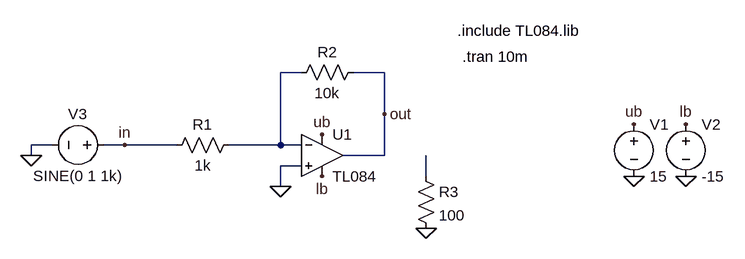
[diagram p0: schematic Labo1_Inverseur.asc]
Labo1_Inverseur.asc, the LTspice schematic file:
Version 4
SHEET 1 880 680
WIRE 128 32 96 32
WIRE 256 32 208 32
WIRE 256 96 256 32
WIRE -256 144 -288 144
WIRE -144 144 -176 144
WIRE -64 144 -144 144
WIRE 96 144 96 32
WIRE 96 144 16 144
WIRE 128 144 96 144
WIRE -288 160 -288 144
WIRE 256 160 256 96
WIRE 256 160 192 160
WIRE 128 176 96 176
WIRE 320 192 320 160
WIRE 96 208 96 176
FLAG 320 272 0
FLAG 256 96 out
FLAG -144 144 in
FLAG 640 192 0
FLAG 720 192 0
FLAG 640 112 ub
FLAG 160 128 ub
FLAG 720 112 lb
FLAG 160 192 lb
FLAG -288 160 0
FLAG 96 208 0
SYMBOL Opamps\\opamp2 160 96 R0
SYMATTR InstName U1
SYMATTR Value TL084
SYMBOL res 224 16 R90
WINDOW 0 0 56 VBottom 2
WINDOW 3 32 56 VTop 2
SYMATTR InstName R2
SYMATTR Value 10k
SYMBOL res 32 128 R90
WINDOW 0 0 56 VBottom 2
WINDOW 3 32 56 VTop 2
SYMATTR InstName R1
SYMATTR Value 1k
SYMBOL voltage 640 96 R0
WINDOW 123 0 0 Left 0
WINDOW 39 0 0 Left 0
SYMATTR InstName V1
SYMATTR Value 15
SYMBOL voltage 720 96 R0
WINDOW 123 0 0 Left 0
WINDOW 39 0 0 Left 0
SYMATTR InstName V2
SYMATTR Value -15
SYMBOL voltage -160 144 R90
WINDOW 0 -32 56 VBottom 2
WINDOW 3 32 56 VTop 2
WINDOW 123 0 0 Left 0
WINDOW 39 0 0 Left 0
SYMATTR InstName V3
SYMATTR Value SINE(0 1 1k)
SYMBOL res 304 176 R0
SYMATTR InstName R3
SYMATTR Value 100
TEXT 368 -32 Left 2 !.include TL084.lib
TEXT 376 8 Left 2 !.tran 10m

The netlist it stands for:
* Labo1_Inverseur.asc
XU1 0 N001 ub lb out TL084  ; pins In+ In- V+ V- OUT
R2 out N001 10k
R1 N001 in 1k
V1 ub 0 15
V2 lb 0 -15
V3 in 0 SINE(0 1 1k)
R3 N002 0 100
.include TL084.lib
.tran 10m
.backanno
.end